# Altium schematic sheet Sheet1.SchDoc
size A
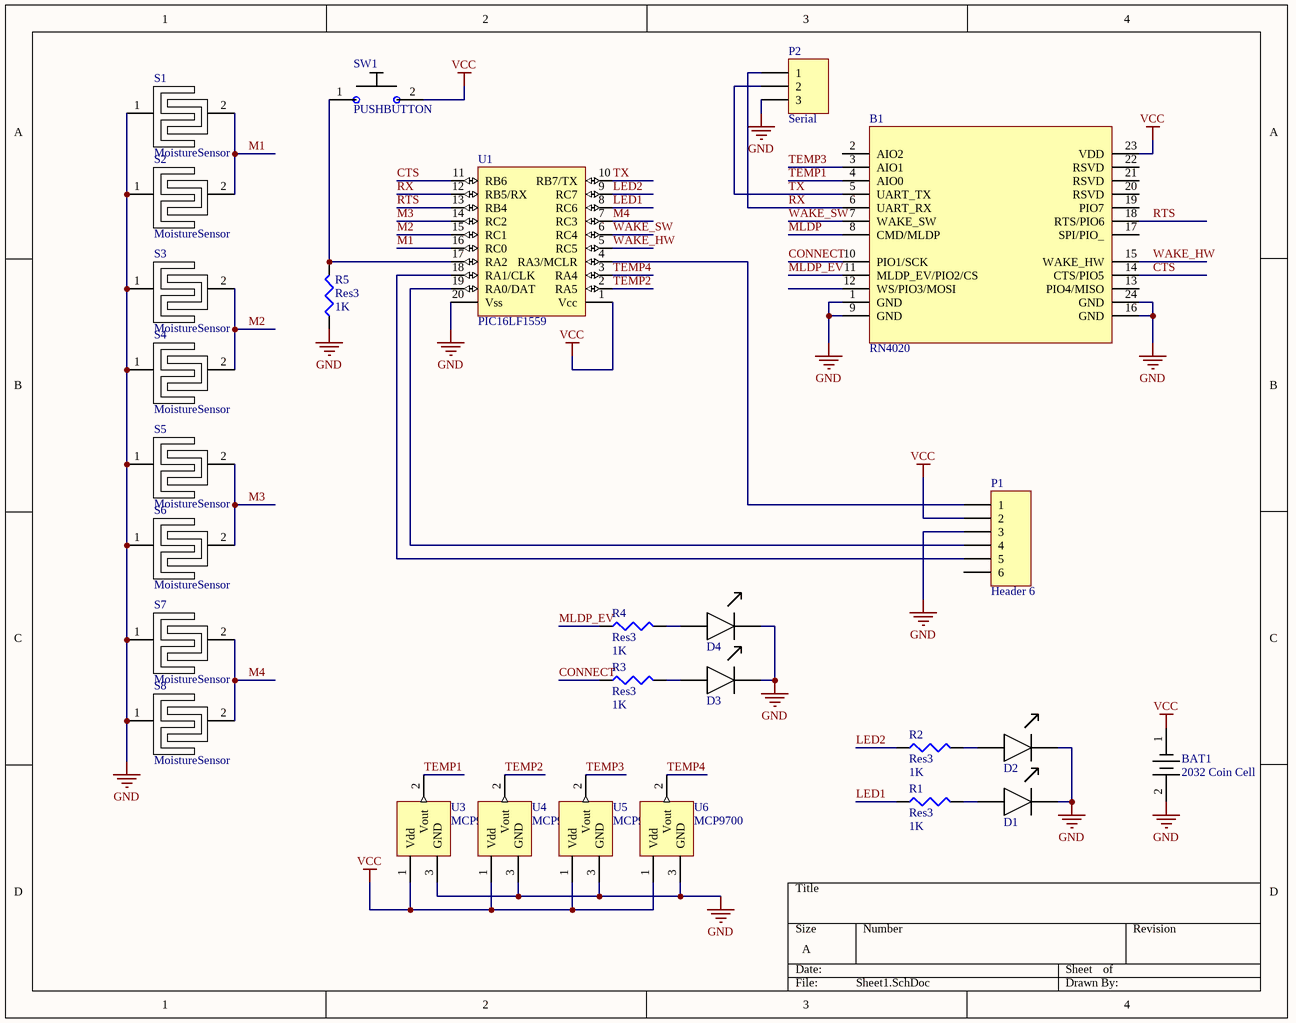
[diagram p0: Sheet1.SchDoc]

## Parts
B1  RN4020  [RN4020 MODULE-24]
BAT1  2032 Coin Cell  [1063TR-CoinCell]
D1  LED  [603_]  (value not drawn)
D2  LED  [603_]  (value not drawn)
D3  LED  [603_]  (value not drawn)
D4  LED  [603_]  (value not drawn)
P1  Header 6  [HDR1X6]
P2  Serial  [HDR1X3]
R1  Res3  value 1K  [J1-0603]
R2  Res3  value 1K  [J1-0603]
R3  Res3  value 1K  [J1-0603]
R4  Res3  value 1K  [J1-0603]
R5  Res3  value 1K  [J1-0603]
S1  MoistureSensor  [MOISTURE_2]
S2  MoistureSensor  [MOISTURE_2]
S3  MoistureSensor  [MOISTURE_2]
S4  MoistureSensor  [MOISTURE_2]
S5  MoistureSensor  [MOISTURE_2]
S6  MoistureSensor  [MOISTURE_2]
S7  MoistureSensor  [MOISTURE_2]
S8  MoistureSensor  [MOISTURE_2]
SW1  PUSHBUTTON  [PUSHBUTTON]
U1  PIC16LF1559  [SSOP-20]
U3  MCP9700  [SOT23_M]
U4  MCP9700  [SOT23_M]
U5  MCP9700  [SOT23_M]
U6  MCP9700  [SOT23_M]

## Nets
GND: B1.1(GND) B1.9(GND) B1.16(GND) B1.24(GND) BAT1.2 D1.2 D2.2 D3.2 D4.2 P1.3 P2.3 R5.1 S1.1 S2.1 S3.1 S4.1 S5.1 S6.1 S7.1 S8.1 U1.20(Vss) U3.3(GND) U4.3(GND) U5.3(GND) U6.3(GND)
VCC: B1.23(VDD) BAT1.1 P1.2 SW1.2 U1.1(Vcc) U3.1(Vdd) U4.1(Vdd) U5.1(Vdd) U6.1(Vdd)
CONNECT: B1.10(PIO1/SCK) R3.1
CTS: B1.14(CTS/PIO5) U1.11(RB6)
LED1: R1.1 U1.8(RC6)
LED2: R2.1 U1.9(RC7)
M1: S1.2 S2.2 U1.16(RC0)
M2: S3.2 S4.2 U1.15(RC1)
M3: S5.2 S6.2 U1.14(RC2)
M4: S7.2 S8.2 U1.7(RC3)
MLDP: B1.8(CMD/MLDP)
MLDP_EV: B1.11(MLDP_EV/PIO2/CS) R4.1
RTS: B1.18(RTS/PIO6) U1.13(RB4)
RX: B1.6(UART_RX) P2.1 U1.12(RB5/RX)
TEMP1: B1.4(AIO0) U3.2(Vout)
TEMP2: U1.2(RA5) U4.2(Vout)
TEMP3: B1.3(AIO1) U5.2(Vout)
TEMP4: U1.3(RA4) U6.2(Vout)
TX: B1.5(UART_TX) P2.2 U1.10(RB7/TX)
WAKE_HW: B1.15(WAKE_HW) U1.5(RC5)
WAKE_SW: B1.7(WAKE_SW) U1.6(RC4)
NetD1_1: D1.1 R1.2
NetD2_1: D2.1 R2.2
NetD3_1: D3.1 R3.2
NetD4_1: D4.1 R4.2
NetP1_1: P1.1 U1.4(RA3/MCLR)
NetP1_4: P1.4 U1.19(RA0/DAT)
NetP1_5: P1.5 U1.18(RA1/CLK)
NetR5_2: R5.2 SW1.1 U1.17(RA2)

Not connected (* = marked no-connect by the designer): B1 2(AIO2) 12(WS/PIO3/MOSI) 13(PIO4/MISO) 17(SPI/PIO_) 19(PIO7) 20(RSVD) 21(RSVD) 22(RSVD); P1 6

## Library data of the parts
P1 = Header 6: Header, 6-Pin; LatestRevisionDate: 17-Jul-2002; LatestRevisionNote: Re-released for DXP Platform.; Publisher: Altium Limited
P2 = Header 3: Header, 3-Pin; LatestRevisionDate: 17-Jul-2002; LatestRevisionNote: Re-released for DXP Platform.; Publisher: Altium Limited
R1-R5 = Res3: Resistor; Published: 8-Jun-2000; LatestRevisionDate: 29-May-2009; LatestRevisionNote: IPC-7351 Footprint Added.; PackageReference: J1-0603; Publisher: Altium Limited; PackageDescription: Chip Resistor
S1-S8 = MoistureSensor: pin to pad: 1>0 2>1
SW1 = PUSHBUTTON: TE 5-1437565-0